# Altium schematic sheet Motor.SchDoc
size A3; SheetNumber: 3; SheetTotal: 5
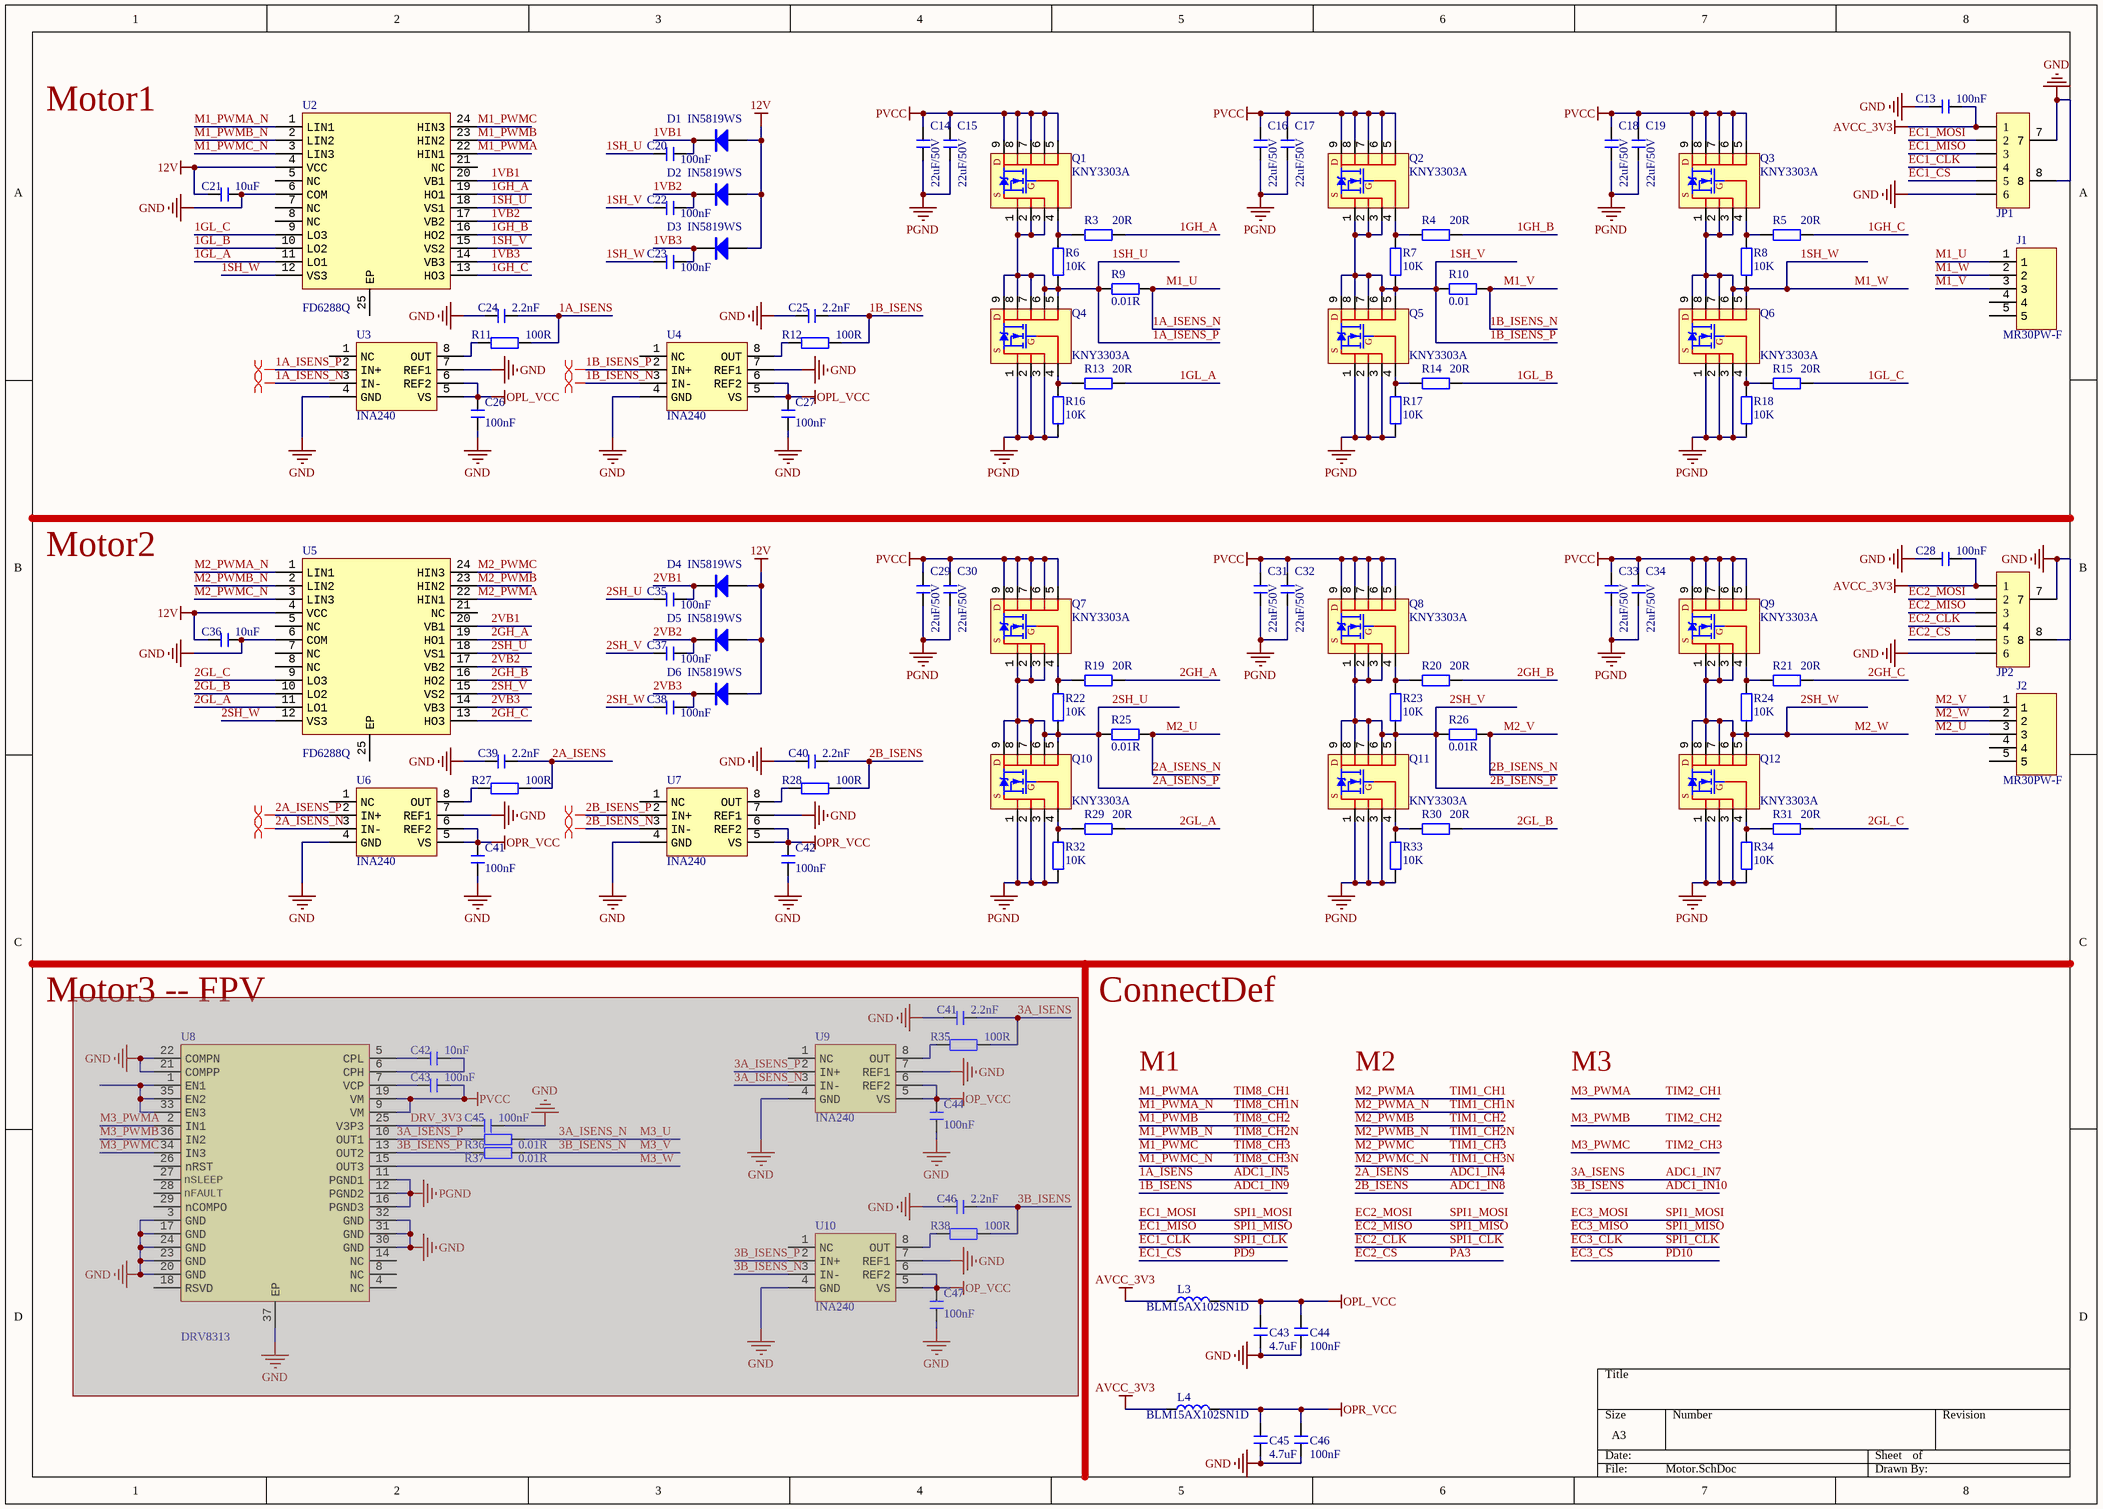
[diagram p0: Motor.SchDoc]

## Parts
(Parts that share a designator on the sheet are numbered #1, #2 ... from top to bottom, then left to right.)
C13  100nF  [C 0402_L]
C14  22uF/50V  [C 1206_L]
C15  22uF/50V  [C 1206_L]
C16  22uF/50V  [C 1206_L]
C17  22uF/50V  [C 1206_L]
C18  22uF/50V  [C 1206_L]
C19  22uF/50V  [C 1206_L]
C20  100nF  [C 0402_L]
C21  10uF  [C 0603_L]
C22  100nF  [C 0402_L]
C23  100nF  [C 0402_L]
C24  2.2nF  [C 0402_L]
C25  2.2nF  [C 0402_L]
C26  100nF  [C 0402_L]
C27  100nF  [C 0402_L]
C28  100nF  [C 0402_L]
C29  22uF/50V  [C 1206_L]
C30  22uF/50V  [C 1206_L]
C31  22uF/50V  [C 1206_L]
C32  22uF/50V  [C 1206_L]
C33  22uF/50V  [C 1206_L]
C34  22uF/50V  [C 1206_L]
C35  100nF  [C 0402_L]
C36  10uF  [C 0603_L]
C37  100nF  [C 0402_L]
C38  100nF  [C 0402_L]
C39  2.2nF  [C 0402_L]
C40  2.2nF  [C 0402_L]
C41#1  100nF  [C 0402_L]
C41#2  2.2nF  [C 0402_L]  (masked out: inside a compile mask, not in the netlist)
C42#1  100nF  [C 0402_L]
C42#2  10nF  [C 0402_L]  (masked out: inside a compile mask, not in the netlist)
C43#1  100nF  [C 0402_L]  (masked out: inside a compile mask, not in the netlist)
C43#2  4.7uF  [C 0402_L]
C44#1  100nF  [C 0402_L]  (masked out: inside a compile mask, not in the netlist)
C44#2  100nF  [C 0402_L]
C45#1  100nF  [C 0402_L]  (masked out: inside a compile mask, not in the netlist)
C45#2  4.7uF  [C 0402_L]
C46#1  2.2nF  [C 0402_L]  (masked out: inside a compile mask, not in the netlist)
C46#2  100nF  [C 0402_L]
C47  100nF  [C 0402_L]  (masked out: inside a compile mask, not in the netlist)
D1  IN5819WS  [SOD-323]
D2  IN5819WS  [SOD-323]
D3  IN5819WS  [SOD-323]
D4  IN5819WS  [SOD-323]
D5  IN5819WS  [SOD-323]
D6  IN5819WS  [SOD-323]
J1  MR30PW-F  [MR30PW_F]
J2  MR30PW-F  [MR30PW_F]
JP1  HDR-1X6  [GH1.25-WS-6P]  (value not drawn)
JP2  HDR-1X6  [GH1.25-WS-6P]  (value not drawn)
L3  BLM15AX102SN1D  [L 0402]
L4  BLM15AX102SN1D  [L 0402]
Q1  KNY3303A  [PDFN-8(5.8x4.9)]
Q2  KNY3303A  [PDFN-8(5.8x4.9)]
Q3  KNY3303A  [PDFN-8(5.8x4.9)]
Q4  KNY3303A  [PDFN-8(5.8x4.9)]
Q5  KNY3303A  [PDFN-8(5.8x4.9)]
Q6  KNY3303A  [PDFN-8(5.8x4.9)]
Q7  KNY3303A  [PDFN-8(5.8x4.9)]
Q8  KNY3303A  [PDFN-8(5.8x4.9)]
Q9  KNY3303A  [PDFN-8(5.8x4.9)]
Q10  KNY3303A  [PDFN-8(5.8x4.9)]
Q11  KNY3303A  [PDFN-8(5.8x4.9)]
Q12  KNY3303A  [PDFN-8(5.8x4.9)]
R3  20R  [R 0402_L]
R4  20R  [R 0402_L]
R5  20R  [R 0402_L]
R6  10K  [R 0402_L]
R7  10K  [R 0402_L]
R8  10K  [R 0402_L]
R9  0.01R  [R 2512_L]
R10  0.01  [R 2512_L]
R11  100R  [R 0402_L]
R12  100R  [R 0402_L]
R13  20R  [R 0402_L]
R14  20R  [R 0402_L]
R15  20R  [R 0402_L]
R16  10K  [R 0402_L]
R17  10K  [R 0402_L]
R18  10K  [R 0402_L]
R19  20R  [R 0402_L]
R20  20R  [R 0402_L]
R21  20R  [R 0402_L]
R22  10K  [R 0402_L]
R23  10K  [R 0402_L]
R24  10K  [R 0402_L]
R25  0.01R  [R 2512_L]
R26  0.01R  [R 2512_L]
R27  100R  [R 0402_L]
R28  100R  [R 0402_L]
R29  20R  [R 0402_L]
R30  20R  [R 0402_L]
R31  20R  [R 0402_L]
R32  10K  [R 0402_L]
R33  10K  [R 0402_L]
R34  10K  [R 0402_L]
R35  100R  [R 0402_L]  (masked out: inside a compile mask, not in the netlist)
R36  0.01R  [RI 1206]  (masked out: inside a compile mask, not in the netlist)
R37  0.01R  [RI 1206]  (masked out: inside a compile mask, not in the netlist)
R38  100R  [R 0402_L]  (masked out: inside a compile mask, not in the netlist)
U2  FD6288Q  [QFN24 4x4_L]
U3  INA240  [SSOP8_L]
U4  INA240  [SSOP8_L]
U5  FD6288Q  [QFN24 4x4_L]
U6  INA240  [SSOP8_L]
U7  INA240  [SSOP8_L]
U8  DRV8313  [VQFN-36-6X6]  (masked out: inside a compile mask, not in the netlist)
U9  INA240  [SSOP8_L]  (masked out: inside a compile mask, not in the netlist)
U10  INA240  [SSOP8_L]  (masked out: inside a compile mask, not in the netlist)

## Nets
12V: C21.1 C36.1 D1.2(K) D2.2(K) D3.2(K) D4.2(K) D5.2(K) D6.2(K) U2.4(VCC) U5.4(VCC)
AVCC_3V3: C13.2 C28.2 JP1.1 JP2.1 L3.1 L4.1
GND: C13.1 C21.2 C24.1 C25.1 C26.1 C27.1 C28.1 C36.2 C39.1 C40.1 C41#1.1 C42#1.1 C43#2.1 C44#2.1 C45#2.1 C46#2.1 JP1.6 JP1.7 JP1.8 JP2.6 JP2.7 JP2.8 U2.6(COM) U3.4(GND) U3.7(REF1) U4.4(GND) U4.7(REF1) U5.6(COM) U6.4(GND) U6.7(REF1) U7.4(GND) U7.7(REF1)
OPL_VCC: C26.2 C27.2 C43#2.2 C44#2.2 L3.2 U3.5(VS) U3.6(REF2) U4.5(VS) U4.6(REF2)
OPR_VCC: C41#1.2 C42#1.2 C45#2.2 C46#2.2 L4.2 U6.5(VS) U6.6(REF2) U7.5(VS) U7.6(REF2)
PGND: C14.1 C15.1 C16.1 C17.1 C18.1 C19.1 C29.1 C30.1 C31.1 C32.1 C33.1 C34.1 Q4.1(S) Q4.2(S) Q4.3(S) Q5.1(S) Q5.2(S) Q5.3(S) Q6.1(S) Q6.2(S) Q6.3(S) Q10.1(S) Q10.2(S) Q10.3(S) Q11.1(S) Q11.2(S) Q11.3(S) Q12.1(S) Q12.2(S) Q12.3(S) R16.1 R17.1 R18.1 R32.1 R33.1 R34.1
PVCC: C14.2 C15.2 C16.2 C17.2 C18.2 C19.2 C29.2 C30.2 C31.2 C32.2 C33.2 C34.2 Q1.5(D) Q1.6(D) Q1.7(D) Q1.8(D) Q1.9(D) Q2.5(D) Q2.6(D) Q2.7(D) Q2.8(D) Q2.9(D) Q3.5(D) Q3.6(D) Q3.7(D) Q3.8(D) Q3.9(D) Q7.5(D) Q7.6(D) Q7.7(D) Q7.8(D) Q7.9(D) Q8.5(D) Q8.6(D) Q8.7(D) Q8.8(D) Q8.9(D) Q9.5(D) Q9.6(D) Q9.7(D) Q9.8(D) Q9.9(D)
1A_ISENS: C24.2 R11.2  [also labelled ADC1_IN5]
1A_ISENS_N: J1.1 R9.2 U3.3(IN-)  [also labelled M1_U]
1A_ISENS_P: C20.1 Q1.1(S) Q1.2(S) Q1.3(S) Q4.5(D) Q4.6(D) Q4.7(D) Q4.8(D) Q4.9(D) R6.1 R9.1 U2.18(VS1) U3.2(IN+)  [also labelled 1SH_U]
1B_ISENS: C25.2 R12.2  [also labelled ADC1_IN9]
1B_ISENS_N: J1.3 R10.2 U4.3(IN-)  [also labelled M1_V]
1B_ISENS_P: C22.1 Q2.1(S) Q2.2(S) Q2.3(S) Q5.5(D) Q5.6(D) Q5.7(D) Q5.8(D) Q5.9(D) R7.1 R10.1 U2.15(VS2) U4.2(IN+)  [also labelled 1SH_V]
1GH_A: R3.2 U2.19(HO1)
1GH_B: R4.2 U2.16(HO2)
1GH_C: R5.2 U2.13(HO3)
1GL_A: R13.2 U2.11(LO1)
1GL_B: R14.2 U2.10(LO2)
1GL_C: R15.2 U2.9(LO3)
1SH_W: C23.1 J1.2 Q3.1(S) Q3.2(S) Q3.3(S) Q6.5(D) Q6.6(D) Q6.7(D) Q6.8(D) Q6.9(D) R8.1 U2.12(VS3)  [also labelled M1_W]
1VB1: C20.2 D1.1(A) U2.20(VB1)
1VB2: C22.2 D2.1(A) U2.17(VB2)
1VB3: C23.2 D3.1(A) U2.14(VB3)
2A_ISENS: C39.2 R27.2  [also labelled ADC1_IN4]
2A_ISENS_N: J2.3 R25.2 U6.3(IN-)  [also labelled M2_U]
2A_ISENS_P: C35.1 Q7.1(S) Q7.2(S) Q7.3(S) Q10.5(D) Q10.6(D) Q10.7(D) Q10.8(D) Q10.9(D) R22.1 R25.1 U5.18(VS1) U6.2(IN+)  [also labelled 2SH_U]
2B_ISENS: C40.2 R28.2  [also labelled ADC1_IN8]
2B_ISENS_N: J2.1 R26.2 U7.3(IN-)  [also labelled M2_V]
2B_ISENS_P: C37.1 Q8.1(S) Q8.2(S) Q8.3(S) Q11.5(D) Q11.6(D) Q11.7(D) Q11.8(D) Q11.9(D) R23.1 R26.1 U5.15(VS2) U7.2(IN+)  [also labelled 2SH_V]
2GH_A: R19.2 U5.19(HO1)
2GH_B: R20.2 U5.16(HO2)
2GH_C: R21.2 U5.13(HO3)
2GL_A: R29.2 U5.11(LO1)
2GL_B: R30.2 U5.10(LO2)
2GL_C: R31.2 U5.9(LO3)
2SH_W: C38.1 J2.2 Q9.1(S) Q9.2(S) Q9.3(S) Q12.5(D) Q12.6(D) Q12.7(D) Q12.8(D) Q12.9(D) R24.1 U5.12(VS3)  [also labelled M2_W]
2VB1: C35.2 D4.1(A) U5.20(VB1)
2VB2: C37.2 D5.1(A) U5.17(VB2)
2VB3: C38.2 D6.1(A) U5.14(VB3)
EC1_CLK: JP1.4 JP2.4  [also labelled EC2_CLK, EC3_CLK, SPI1_CLK]
EC1_CS: JP1.5  [also labelled PD9]
EC1_MISO: JP1.3 JP2.3  [also labelled EC2_MISO, EC3_MISO, SPI1_MISO]
EC1_MOSI: JP1.2 JP2.2  [also labelled EC2_MOSI, EC3_MOSI, SPI1_MOSI]
EC2_CS: JP2.5  [also labelled PA3]
M1_PWMA: U2.22(HIN1)  [also labelled TIM8_CH1]
M1_PWMA_N: U2.1(LIN1)  [also labelled TIM8_CH1N]
M1_PWMB: U2.23(HIN2)  [also labelled TIM8_CH2]
M1_PWMB_N: U2.2(LIN2)  [also labelled TIM8_CH2N]
M1_PWMC: U2.24(HIN3)  [also labelled TIM8_CH3]
M1_PWMC_N: U2.3(LIN3)  [also labelled TIM8_CH3N]
M2_PWMA: U5.22(HIN1)  [also labelled TIM1_CH1]
M2_PWMA_N: U5.1(LIN1)  [also labelled TIM1_CH1N]
M2_PWMB: U5.23(HIN2)  [also labelled TIM1_CH2]
M2_PWMB_N: U5.2(LIN2)  [also labelled TIM1_CH2N]
M2_PWMC: U5.24(HIN3)  [also labelled TIM1_CH3]
M2_PWMC_N: U5.3(LIN3)  [also labelled TIM1_CH3N]
NetQ1_4: Q1.4(G) R3.1 R6.2
NetQ2_4: Q2.4(G) R4.1 R7.2
NetQ3_4: Q3.4(G) R5.1 R8.2
NetQ4_4: Q4.4(G) R13.1 R16.2
NetQ5_4: Q5.4(G) R14.1 R17.2
NetQ6_4: Q6.4(G) R15.1 R18.2
NetQ7_4: Q7.4(G) R19.1 R22.2
NetQ8_4: Q8.4(G) R20.1 R23.2
NetQ9_4: Q9.4(G) R21.1 R24.2
NetQ10_4: Q10.4(G) R29.1 R32.2
NetQ11_4: Q11.4(G) R30.1 R33.2
NetQ12_4: Q12.4(G) R31.1 R34.2
NetR11_1: R11.1 U3.8(OUT)
NetR12_1: R12.1 U4.8(OUT)
NetR27_1: R27.1 U6.8(OUT)
NetR28_1: R28.1 U7.8(OUT)

Not connected (* = marked no-connect by the designer): J1 4 5; J2 4 5; U2 5(NC) 7(NC) 8(NC) 21(NC) 25(EP); U3 1(NC); U4 1(NC); U5 5(NC) 7(NC) 8(NC) 21(NC) 25(EP); U6 1(NC); U7 1(NC)

## Layout directives
differential pair: 1A_ISENS_N, 1A_ISENS_P, 1B_ISENS_N, 1B_ISENS_P, 2A_ISENS_N, 2A_ISENS_P, 2B_ISENS_N, 2B_ISENS_P

## Notes on the sheet
- Motor1
- Motor2
- (near U8) Motor3 -- FPV
- ConnectDef
- M1
- M2
- M3

## Library data of the parts
C13-C40 C41#1 C41#2 C42#1 C42#2 C43#1 C43#2 C44#1 C44#2 C45#1 C45#2 C46#1 C46#2 C47 = C: 无极性贴片电容; 版权归属: 源创客; BOM名称: 无极性贴片电容; 学习资源: www.ooocke.com
D1-D6 = 1N5819: 肖特基二极管; 版权归属: 源创客; 属性: 40V/2A; BOM名称: 肖特基二极管; 学习资源: www.ooocke.com
J1 J2 = MR30PW-F: 航模接口
JP1 JP2 = Header 6: 6P接插件; 版权归属: 源创客; BOM名称: 6P接插件; 学习资源: www.ooocke.com
L3 L4 = L: 小功率贴片电感; 版权归属: 源创客; BOM名称: 小功率贴片电感; 学习资源: www.ooocke.com
Q1-Q12 = KNY3303A: N沟道MOS管 / PDFN-8(5.8x4.9)
R3-R35 R38 = R: 贴片电阻; 版权归属: 源创客; BOM名称: 贴片电阻; 学习资源: www.ooocke.com
R36 R37 = R-I: 电流检测电阻; 版权归属: 源创客; BOM名称: 电流检测电阻; 学习资源: www.ooocke.com
U2 U5 = FD6288Q: 栅极驱动IC
U3 U4 U6 U7 U9 U10 = INA240: PWM抑制电流检测芯片
U8 = DRV8313: 集成FET的3路半桥驱动器 / 3A